# Altium project mPCIe_Breakout01.PrjPCB
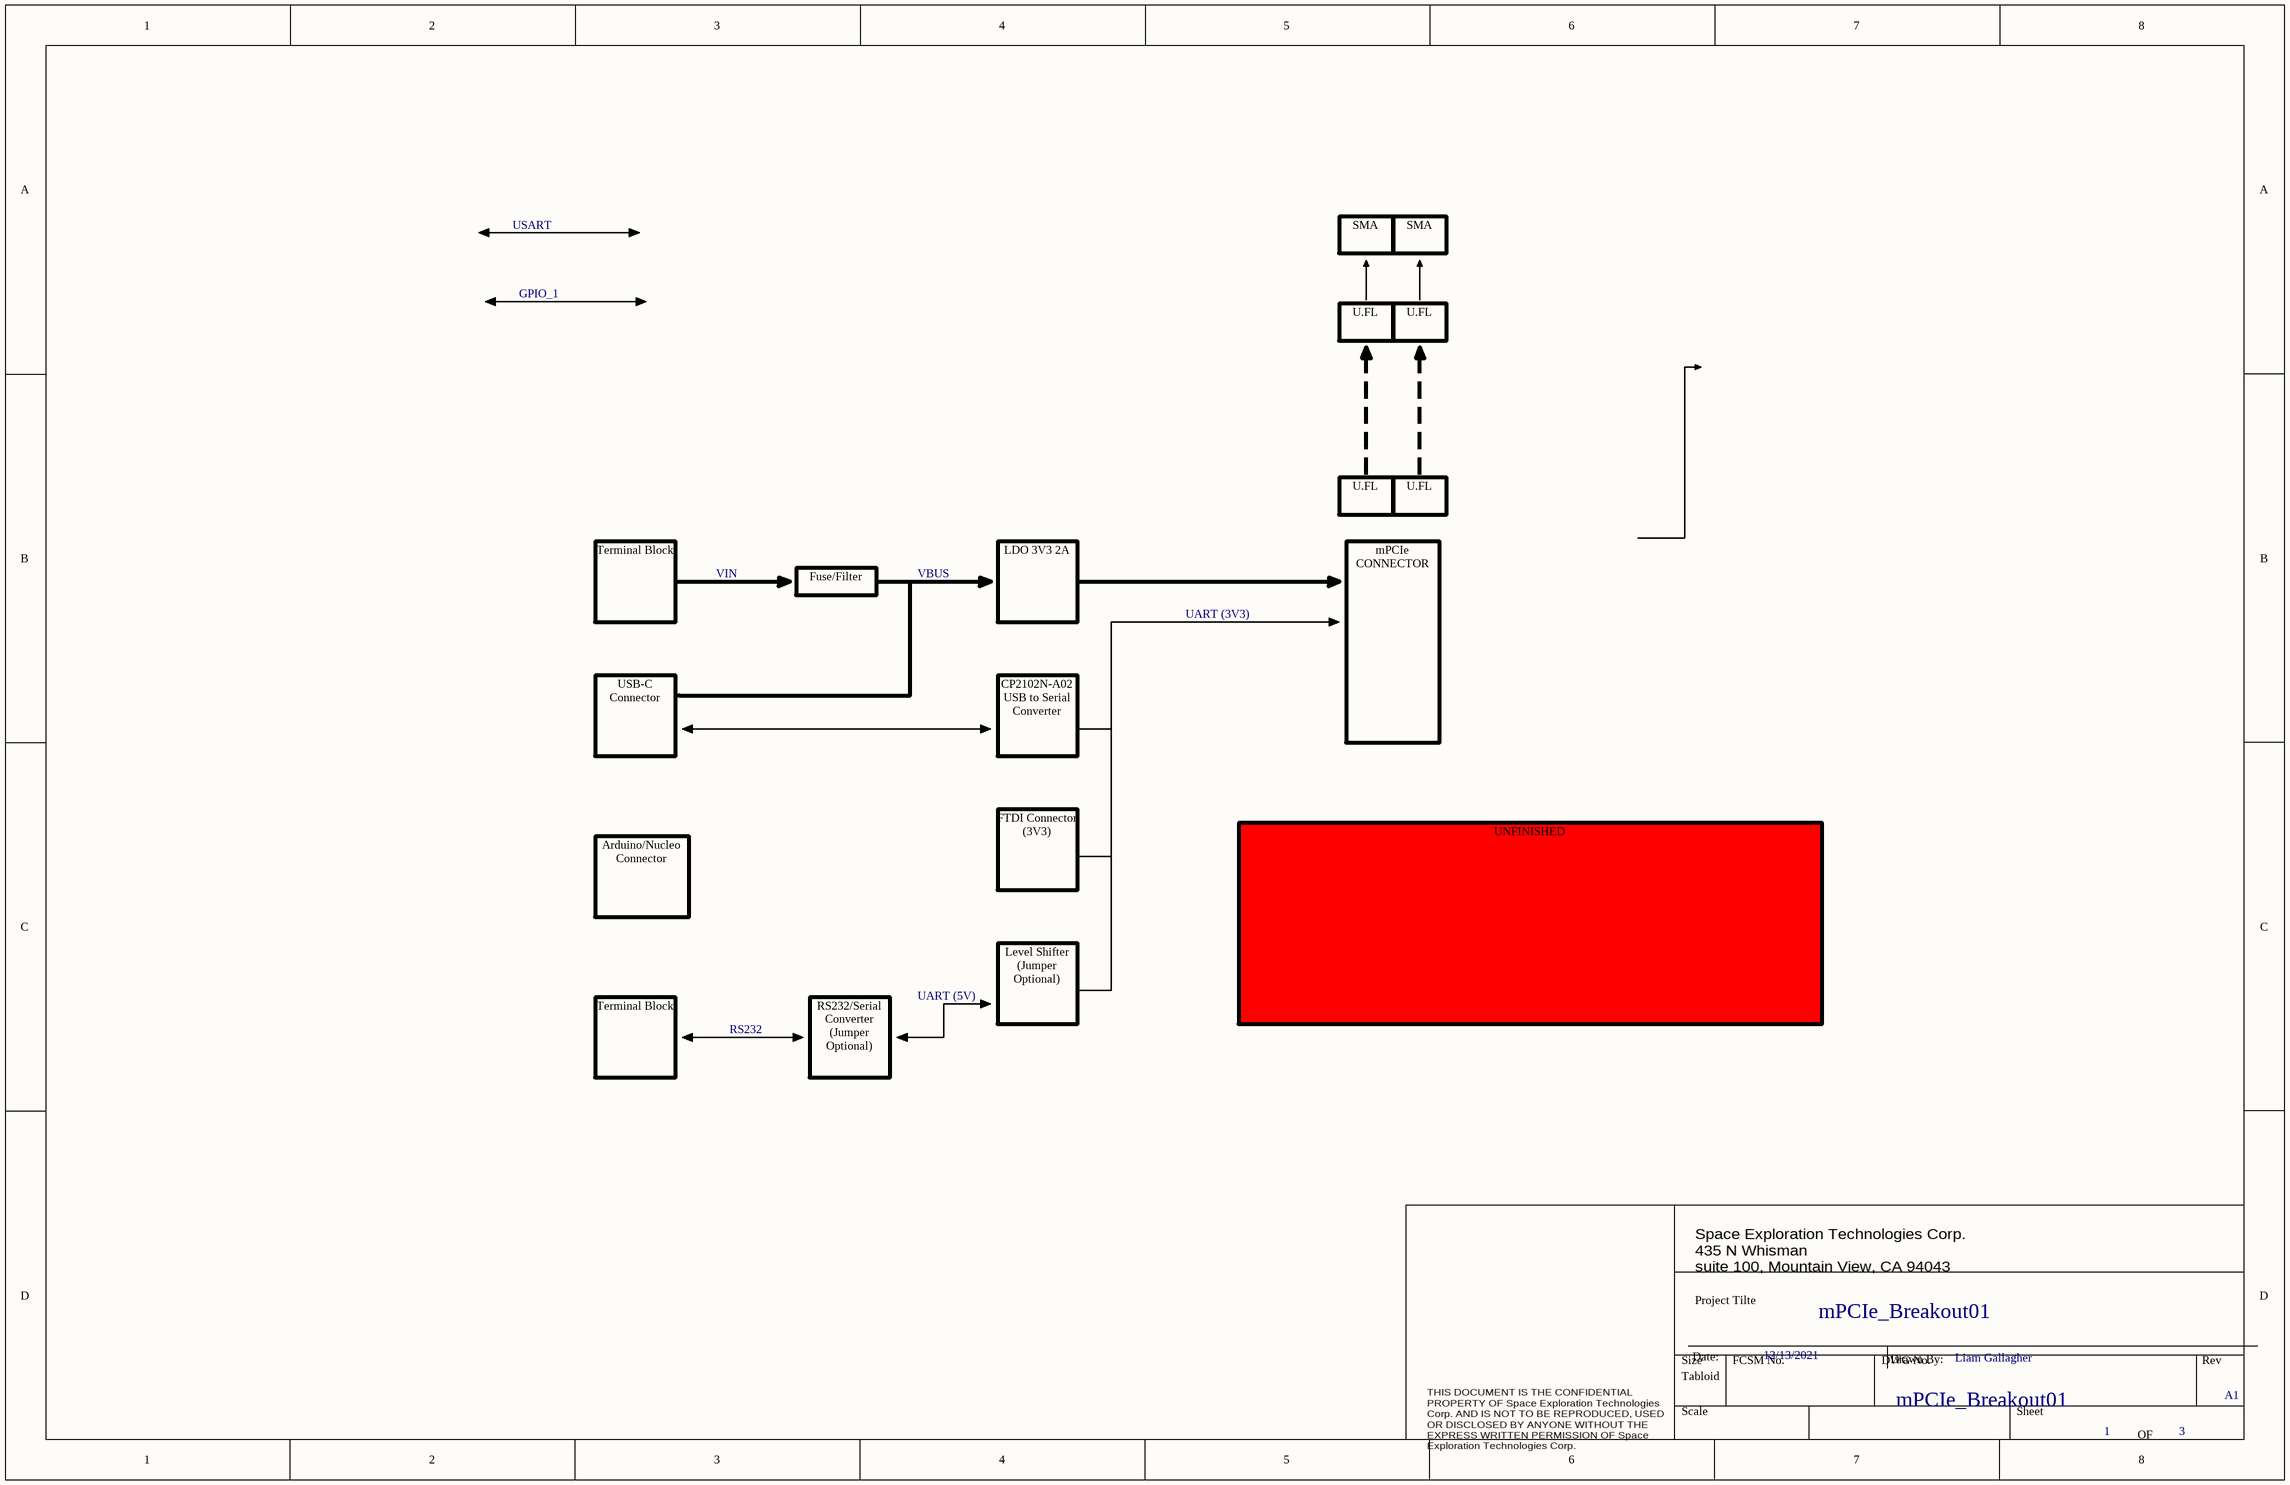
[diagram p0: mPCIe_Breakout01_SCH-PAGE1_TITLE.SchDoc]
Address1: SpaceX; ASSY1_REV: A1; ASSY_NUMBER_1: mPCIe_Breakout01; Company: WWW.SWARM.SPACE; Drawn_By: Liam Gallagher; Drawn_By_Date: 12/13/2021; Engineer: Liam Gallagher; Model: mPCIe_Breakout01; PCB_NUMBER: mPCIe_Breakout01; PCB_REV: A1; Phone#: 3035884323; PRODUCT_GROUP: RF MODULE; Project_Title: mPCIe_Breakout01; Project Root Number: mPCIe_Breakout01; SCH_REV: A1; Schematic: mPCIe_Breakout01; Soldermask_Color: BLACK
3 sheets, 106 parts. Net scope: flat (ports and power ports of the same name join across sheets).
Board files: mPCIe_Breakout01_2X2_PNL.PcbDoc, mPCIe_Breakout01_BRD1.PcbDoc, mPCIe_Breakout01_PCBONLY__12132021847.PcbDoc
Sheets:
  mPCIe_Breakout01_SCH-PAGE1_TITLE.SchDoc
  mPCIe_Breakout01-SCH-PAGE2_MAIN.SchDoc
  mPCIe_Breakout01_SCH-PAGE3_POWER_SUPPLY.SchDoc

## Sheet mPCIe_Breakout01_SCH-PAGE1_TITLE.SchDoc: Swarm mPCIe Breakout
size Tabloid; Date: 12/13/2021; DrawnBy: Liam Gallagher; DocumentNumber: 1; Revision: X1; SheetNumber: 1; SheetTotal: 3

### Notes on the sheet
- USART
- GPIO_1
- SMA
- U.FL
- Terminal Block
- VIN
- Fuse/Filter
- VBUS
- LDO 3V3 2A
- UART (3V3)
- USB-C Connector
- CP2102N-A02
  USB to Serial Converter
- mPCIe CONNECTOR
- FTDI Connector (3V3)
- Arduino/Nucleo Connector
- RS232
- UART (5V)
- Level Shifter
  (Jumper Optional)
- UNFINISHED
- RS232/Serial Converter
  (Jumper Optional)
- Space Exploration Technologies Corp.
  435 N Whisman
  suite 100, Mountain View, CA 94043
- CONFIDENTIAL
- Date:
- Project Tilte
- Drawn By:
- THIS DOCUMENT IS THE CONFIDENTIAL PROPERTY OF Space Exploration Technologies Corp. AND IS NOT TO BE REPRODUCED, USED OR DISCLOSED BY ANYONE WITHOUT THE EXPRESS WRITTEN PERMISSION OF Space Exploration Technologies Corp.
- OF

## Sheet mPCIe_Breakout01-SCH-PAGE2_MAIN.SchDoc: SWARM GATEWAY MCU
size Tabloid; PageSetup: Record=PageOptions|CenterHorizontal=True|CenterVertical=True|PrintScale=0.61|XCorrection=1.00|YCorrection=1.00|PrintKind=1|BorderSize=5000000|LeftOffset=0|BottomOffset=0|Orientation=2|PaperLength=1000|PaperWidth=1000|Scale=100|PaperSource=7|PrintQuality=-4|MediaType=1|DitherType=10|PaperKind=Letter (8.5" x 11")|PrintScaleMode=1; Address1: SpaceX; Address2: SpaceX; DocumentNumber: 2; SheetNumber: 2; SheetTotal: 3; SheetName: Swarm Embedded Gateway MCU
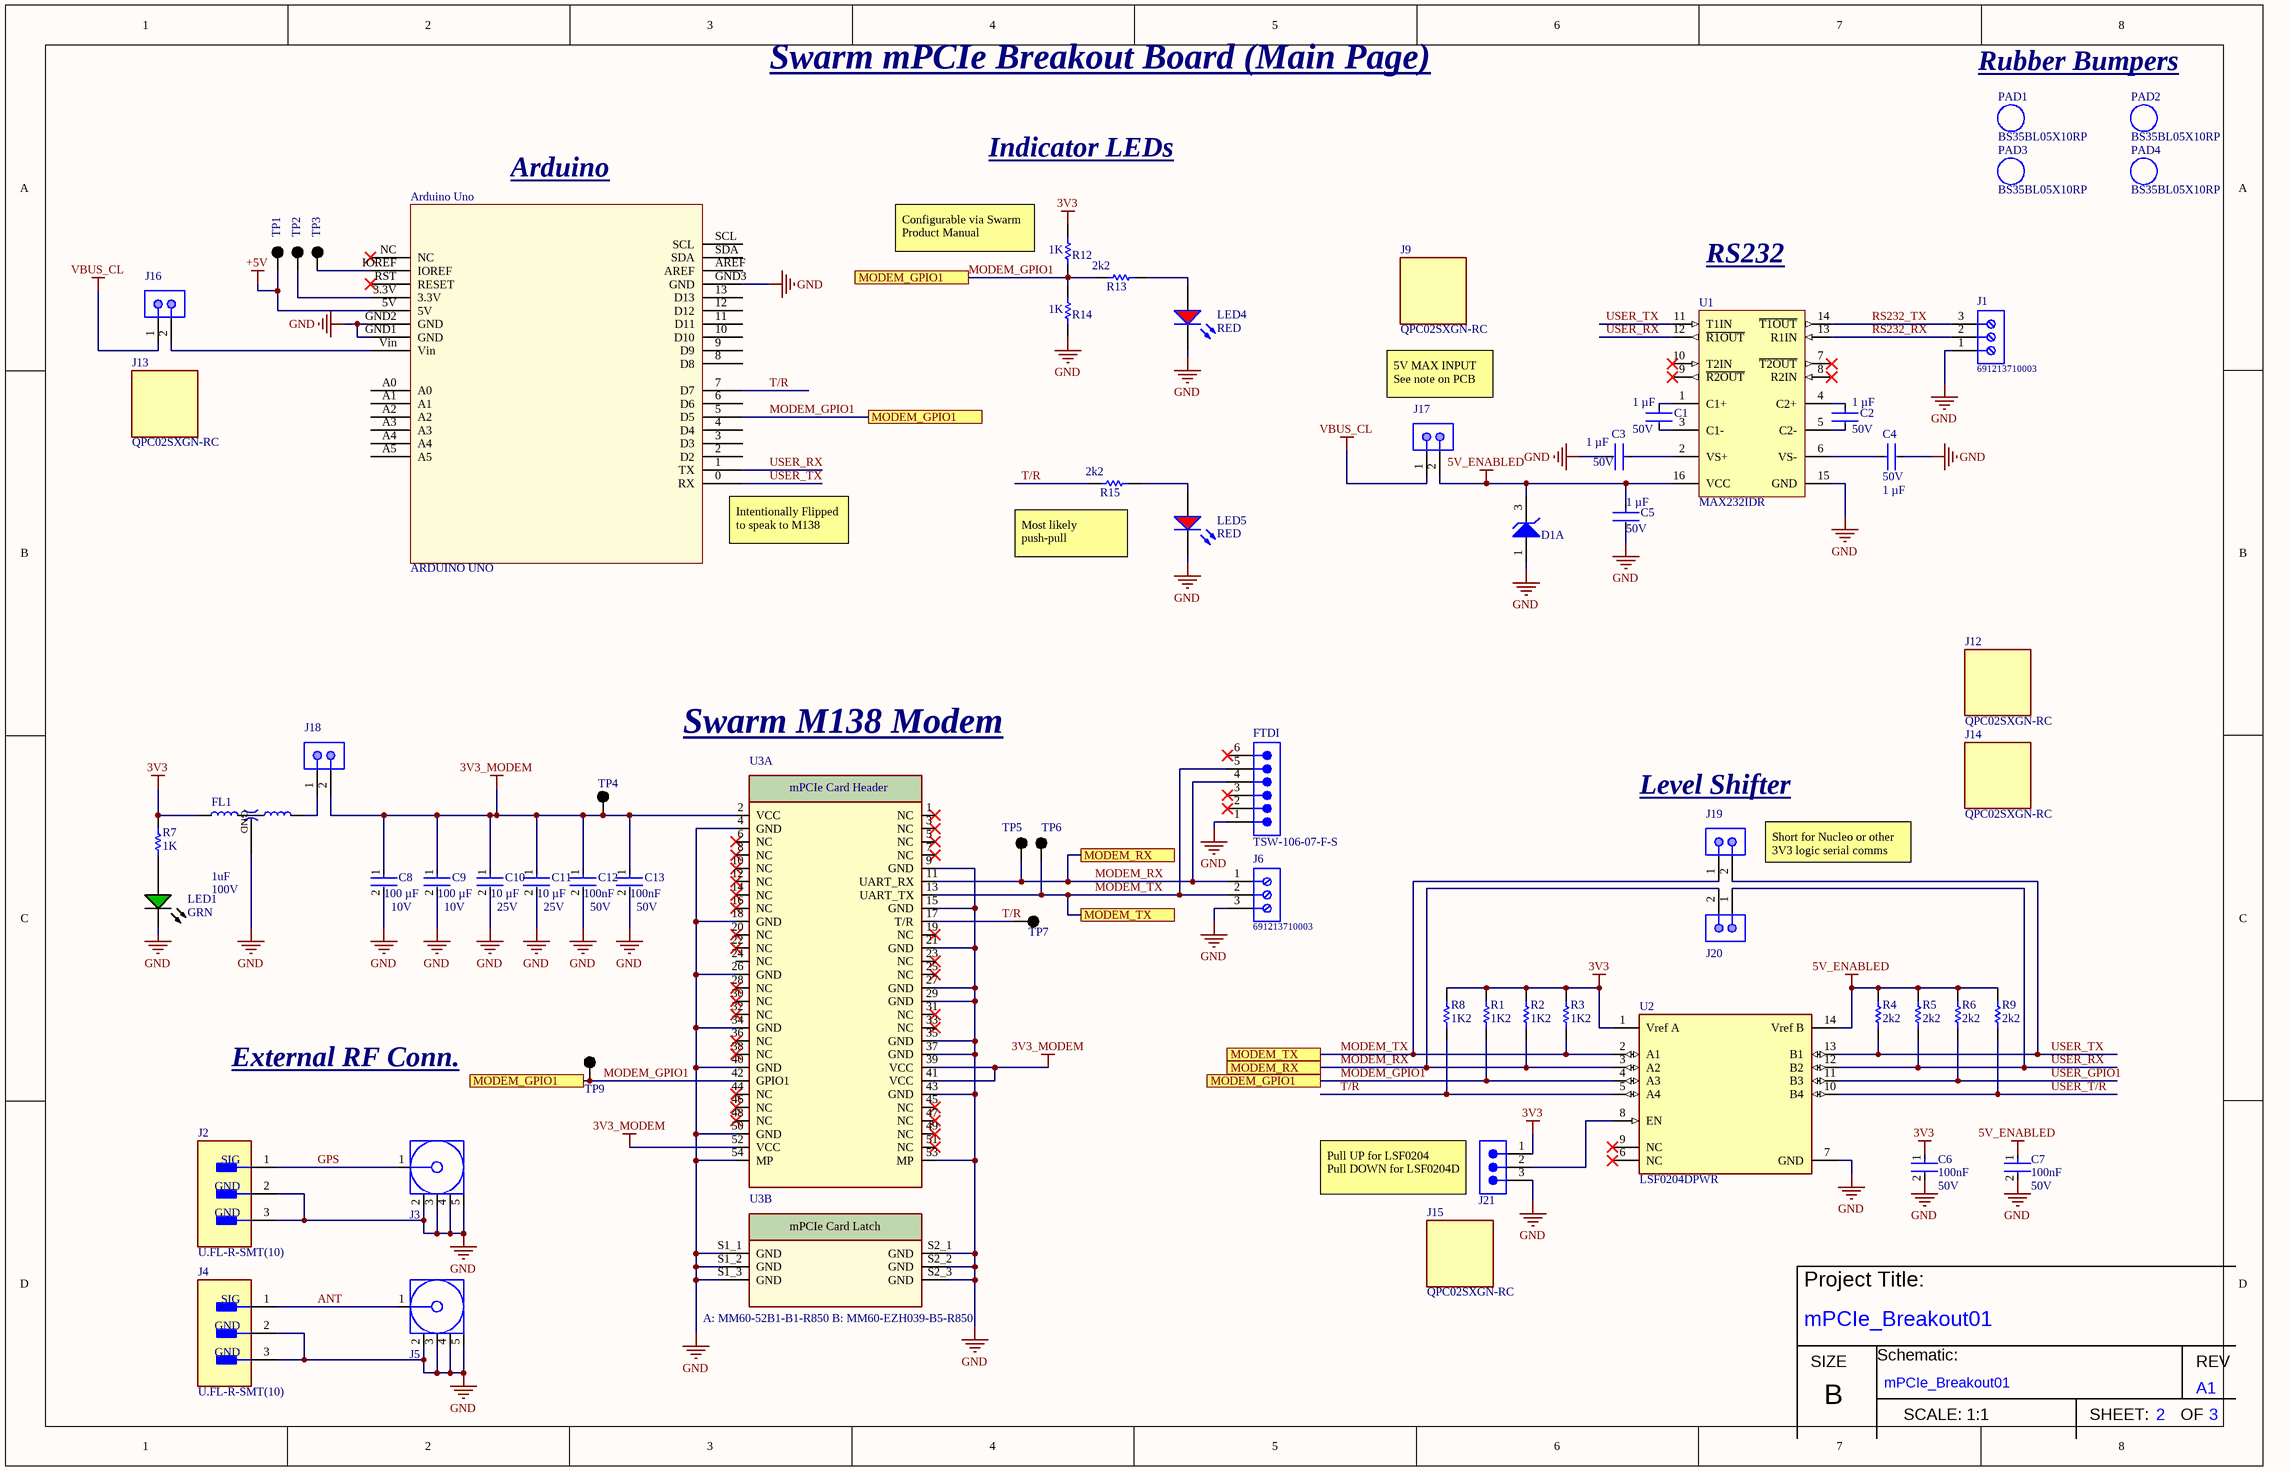
[diagram p1: mPCIe_Breakout01-SCH-PAGE2_MAIN.SchDoc]

### Parts
(Parts that share a designator on the sheet are numbered #1, #2 ... from top to bottom, then left to right.)
?#1  TitleBlock_SpaceX  (value not drawn)  (graphical)
Arduino_Uno  ARDUINO UNO  [Arduino Uno]  (no BOM)
C1  value 1 µF  Voltage: 50V  [FP-CL21-IPC_C]  (hidden comment: CL21B105KBFNNNG)
C2  value 1 µF  Voltage: 50V  [FP-CL21-IPC_C]  (hidden comment: CL21B105KBFNNNG)
C3  value 1 µF  Voltage: 50V  [FP-CL21-IPC_C]  (hidden comment: CL21B105KBFNNNG)
C4  value 1 µF  Voltage: 50V  [FP-CL21-IPC_C]  (hidden comment: CL21B105KBFNNNG)
C5  value 1 µF  Voltage: 50V  [FP-CL21-IPC_C]  (hidden comment: CL21B105KBFNNNG)
C6  value 100nF  Voltage: 50V  [FP-CL10-0_1-MFG]  (hidden comment: CGA3E2X7R1H104K080AA)
C7  value 100nF  Voltage: 50V  [FP-CL10-0_1-MFG]  (hidden comment: CGA3E2X7R1H104K080AA)
C8  value 100 µF  Voltage: 10V  [FP-GRM32E-0_3-0_2-IPC_B]  (hidden comment: GRM32ER61A107ME20L)
C9  value 100 µF  Voltage: 10V  [FP-GRM32E-0_3-0_2-IPC_B]  (hidden comment: GRM32ER61A107ME20L)
C10  value 10 µF  Voltage: 25V  [FP-GRM21B-0_15-IPC_C]  (hidden comment: GRM21BR61E106KA73L)
C11  value 10 µF  Voltage: 25V  [FP-GRM21B-0_15-IPC_C]  (hidden comment: GRM21BR61E106KA73L)
C12  value 100nF  Voltage: 50V  [FP-CL10-0_1-MFG]  (hidden comment: CGA3E2X7R1H104K080AA)
C13  value 100nF  Voltage: 50V  [FP-CL10-0_1-MFG]  (hidden comment: CGA3E2X7R1H104K080AA)
D1  BZX84B5V1LT1G  [ONSC-SOT-23-3-318-08_V]  (value not drawn)  (part A of 2)
FL1  value 1uF  Voltage: 100V  [FIL_YFF31HC2A104MT000N_YFF31HC2A104MT000N]  (hidden comment: YFF31HC2A105MT000N)
FTDI  TSW-106-07-F-S  [SMTC-TSW-106-07-X-S]
J1  691213710003  [691213710003]
J2  U.FL-R-SMT(10)  [FP-U_FL-R-SMT_10-MFG]
J3  CMP-2000-05705-2  [TECO-5-1814832-1_V]  (value not drawn)
J4  U.FL-R-SMT(10)  [FP-U_FL-R-SMT_10-MFG]
J5  CMP-2000-05705-2  [TECO-5-1814832-1_V]  (value not drawn)
J6  691213710003  [691213710003]
J9  QPC02SXGN-RC  [FP-QPC02SXGN-RC-MFG]
J12  QPC02SXGN-RC  [FP-QPC02SXGN-RC-MFG]
J13  QPC02SXGN-RC  [FP-QPC02SXGN-RC-MFG]
J14  QPC02SXGN-RC  [FP-QPC02SXGN-RC-MFG]
J15  QPC02SXGN-RC  [FP-QPC02SXGN-RC-MFG]
J16  TSW-102-07-S-S  [SMTC-TSW-102-07-S-S]  (value not drawn)
J17  TSW-102-07-S-S  [SMTC-TSW-102-07-S-S]  (value not drawn)
J18  TSW-102-07-S-S  [SMTC-TSW-102-07-S-S]  (value not drawn)
J19  TSW-102-07-S-S  [SMTC-TSW-102-07-S-S]  (value not drawn)
J20  TSW-102-07-S-S  [SMTC-TSW-102-07-S-S]  (value not drawn)
J21  TSW-103-07-L-S  [SMTC-TSW-103-07-X-S]  (value not drawn)
LED1  value GRN  [WE-150060VS75000_V]  (hidden comment: 150060VS75000)
LED4  value RED  [0603_A]  (hidden comment: 150060RS75000)
LED5  value RED  [0603_A]  (hidden comment: 150060RS75000)
PAD1  BS35BL05X10RP  [Bumper]
PAD2  BS35BL05X10RP  [Bumper]
PAD3  BS35BL05X10RP  [Bumper]
PAD4  BS35BL05X10RP  [Bumper]
R1  value 1K2  [RESC1608X55X30LL15T15]  (hidden comment: ERJ-3GEYJ122V)
R2  value 1K2  [RESC1608X55X30LL15T15]  (hidden comment: ERJ-3GEYJ122V)
R3  value 1K2  [RESC1608X55X30LL15T15]  (hidden comment: ERJ-3GEYJ122V)
R4  value 2k2  [RESC1609X50X30LL10T20]  (hidden comment: CRCW06032K20JNEA)
R5  value 2k2  [RESC1609X50X30LL10T20]  (hidden comment: CRCW06032K20JNEA)
R6  value 2k2  [RESC1609X50X30LL10T20]  (hidden comment: CRCW06032K20JNEA)
R7  value 1K  [RESC1608X55X30LL20T20]  (hidden comment: ERA3AEB102V)
R8  value 1K2  [RESC1608X55X30LL15T15]  (hidden comment: ERJ-3GEYJ122V)
R9  value 2k2  [RESC1609X50X30LL10T20]  (hidden comment: CRCW06032K20JNEA)
R12  value 1K  [RESC1608X55X30LL20T20]  (hidden comment: ERA3AEB102V)
R13  value 2k2  [RESC1609X50X30LL10T20]  (hidden comment: CRCW06032K20JNEA)
R14  value 1K  [RESC1608X55X30LL20T20]  (hidden comment: ERA3AEB102V)
R15  value 2k2  [RESC1609X50X30LL10T20]  (hidden comment: CRCW06032K20JNEA)
TP1  5001  [KSTN-5001]  (value not drawn)
TP2  5001  [KSTN-5001]  (value not drawn)
TP3  5001  [KSTN-5001]  (value not drawn)
TP4  5001  [KSTN-5001]  (value not drawn)
TP5  5001  [KSTN-5001]  (value not drawn)
TP6  5001  [KSTN-5001]  (value not drawn)
TP7  5001  [KSTN-5001]  (value not drawn)
TP9  5001  [KSTN-5001]  (value not drawn)
U1  MAX232IDR  [D0016A_M]
U2  LSF0204DPWR  [FP-PW0014A-IPC_B]
U3  A: MM60-52B1-B1-R850 B: MM60-EZH039-B5-R850  [RF_VHF_JAE_MM60-52B1-B1-R850_MM60-EZH039-B5-R850_w_2005_mPCIe_card]  (parts A,B of 2)

### Ports
MODEM_GPIO1, MODEM_RX, MODEM_TX

### Nets
3V3: C6.1 FL1.3(OUT/IN) J21.1 R1.2 R2.2 R3.2 R7.2 R8.2 R12.2 U2.1(Vref_A)
3V3_MODEM: C8.1 C9.1 C10.1 C11.1 C12.1 C13.1 J18.2 TP4.1 U3.2(VCC) U3.39(VCC) U3.41(VCC) U3.52(VCC)
5V_ENABLED: C5.1 C7.1 D1.3(K) J17.2 R4.2 R5.2 R6.2 R9.2 U1.16(VCC) U2.14(Vref_B)
+5V: Arduino_Uno.5V TP1.1
GND: Arduino_Uno.GND1(GND) Arduino_Uno.GND2(GND) Arduino_Uno.GND3(GND) C3.2 C4.2 C5.2 C6.2 C7.2 C8.2 C9.2 C10.2 C11.2 C12.2 C13.2 D1.1(A) FL1.2_4(GND) FTDI.1 J1.1 J2.2(GND) J2.3(GND) J3.2 J3.3 J3.4 J3.5 J4.2(GND) J4.3(GND) J5.2 J5.3 J5.4 J5.5 J6.3 J21.3 LED1.1(K) LED4.1(K) LED5.1(K) R14.1 U1.15(GND) U2.7(GND) U3.4(GND) U3.9(GND) U3.15(GND) U3.18(GND) U3.21(GND) U3.26(GND) U3.27(GND) U3.29(GND) U3.34(GND) U3.35(GND) U3.37(GND) U3.40(GND) U3.43(GND) U3.50(GND) U3.53(MP) U3.54(MP) U3.S1_1(GND) U3.S1_2(GND) U3.S1_3(GND) U3.S2_1(GND) U3.S2_2(GND) U3.S2_3(GND)
VBUS_CL: J16.1 J17.1
ANT: J4.1(SIG) J5.1
GPS: J2.1(SIG) J3.1
MODEM_GPIO1: Arduino_Uno.5(D5) R1.1 R12.1 R13.2 R14.2 TP9.1 U2.4(A3) U3.42(GPIO1) ; port MODEM_GPIO1
MODEM_RX: FTDI.4 J6.1 J20.2 R2.1 TP5.1 U2.3(A2) U3.11(UART_RX) ; port MODEM_RX
MODEM_TX: FTDI.5 J6.2 J19.1 R3.1 TP6.1 U2.2(A1) U3.13(UART_TX) ; port MODEM_TX
RS232_RX: J1.2 U1.13(R1IN)
RS232_TX: J1.3 U1.14(~{T1OUT})
T/R: Arduino_Uno.7(D7) R8.1 R15.2 TP7.1 U2.5(A4) U3.17(T/R)
USER_GPIO1: R6.1 U2.11(B3)
USER_RX: Arduino_Uno.1(TX) J20.1 R5.1 U1.12(~{R1OUT}) U2.12(B2)
USER_T/R: R9.1 U2.10(B4)
USER_TX: Arduino_Uno.0(RX) J19.2 R4.1 U1.11(T1IN) U2.13(B1)
NetArduino_Uno_3.3V: Arduino_Uno.3.3V TP2.1
NetArduino_Uno_IOREF: Arduino_Uno.IOREF TP3.1
NetArduino_Uno_Vin: Arduino_Uno.Vin J16.2
NetC1_1: C1.1 U1.1(C1+)
NetC1_2: C1.2 U1.3(C1-)
NetC2_1: C2.1 U1.4(C2+)
NetC2_2: C2.2 U1.5(C2-)
NetC3_1: C3.1 U1.2(VS+)
NetC4_1: C4.1 U1.6(VS-)
NetFL1_1: FL1.1(IN/OUT) J18.1
NetJ21_2: J21.2 U2.8(EN)
NetLED1_2: LED1.2(A) R7.1
NetLED4_2: LED4.2(A) R13.1
NetLED5_2: LED5.2(A) R15.1

Not connected (* = marked no-connect by the designer): Arduino_Uno 2(D2) 3(D3) 4(D4) 6(D6) 8(D8) 9(D9) 10(D10) 11(D11) 12(D12) 13(D13) A0 A1 A2 A3 A4 A5 AREF NC* RST(RESET)* SCL SDA; FTDI 2* 3* 6*; U1 7(~{T2OUT})* 8(R2IN)* 9(~{R2OUT})* 10(T2IN)*; U2 6(NC)* 9(NC)*; U3 1(NC)* 3(NC)* 5(NC)* 6(NC)* 7(NC)* 8(NC)* 10(NC)* 12(NC)* 14(NC)* 16(NC)* 19(NC)* 20(NC)* 22(NC)* 23(NC)* 24(NC) 25(NC)* 28(NC)* 30(NC)* 31(NC)* 32(NC)* 33(NC)* 36(NC)* 38(NC)* 44(NC)* 45(NC)* 46(NC)* 47(NC)* 48(NC)* 49(NC)* 51(NC)*

### Notes on the sheet
- Swarm mPCIe Breakout Board (Main Page)
- Rubber Bumpers
- Indicator LEDs
- Arduino
- (near R12) Configurable via Swarm Product Manual
- RS232
- 5V MAX INPUT
  See note on PCB
- (near Arduino_Uno) Intentionally Flipped to speak to M138
- (near R15) Most likely push-pull
- Swarm M138 Modem
- Level Shifter
- (near J19) Short for Nucleo or other 3V3 logic serial comms
- External RF Conn.
- Pull UP for LSF0204
  Pull DOWN for LSF0204D
- (in symbol SWARM_M138_mPCIe_2.005"_VHF, part A) mPCIe Card Header
- (in symbol SWARM_M138_mPCIe_2.005"_VHF, part B) mPCIe Card Latch
- (in symbol TitleBlock_SpaceX) Project Title:; Schematic:; SIZE; REV; B; SCALE: 1:1; SHEET:       OF

### Library data of the parts
?#1 = TitleBlock_SpaceX: TITLE
Arduino_Uno = ARDUINO UNO: UNO; MANUF1: TBD; Value: TBD; MANUF1 P/N: TBD; Manufacturer: TBD; Manufacturer Part Number: TBD; Size: TH; SPECIAL_INSTRUCTIONS: TBD; Supplier: Digi-Key; Supplier P/N: TBD; TEMP: TBD; Tolerance: TBD; Type: TBD; Voltage: TBD
C1-C5 = CMP-13271-001433-1: CL21 Series 0805 1uF 50V ±10% Tolerance X7R Multilayer Ceramic Chip Capacitor; Manufacturer: Samsung; TEMP: -55°C ~ 125°C; Type: CAP; Tolerance: 10%; Manufacturer Part Number: CL21B105KBFNNNG; MANUF1: Samsung; MANUF1 P/N: CL21B105KBFNNNG; Size: 0805; SPECIAL_INSTRUCTIONS: CL21B105KBFNNNG; Supplier: Digi-Key; Supplier P/N: 1276-6470-2-ND
C6 C7 C12 C13 = CMP-13271-000011-1: Cap Ceramic 100nF 50V X7R 10% Pad SMD 0603 +125°C Automotive T/R; Manufacturer: TDK; TEMP: -55°C ~ 125°C; Tolerance: 10%; Manufacturer Part Number: CGA3E2X7R1H104K080AA; MANUF1: TDK; MANUF1 P/N: CGA3E2X7R1H104K080AA; Size: 0603; SPECIAL_INSTRUCTIONS: CGA3E2X7R1H104K080AA; Supplier: Digi-Key; Supplier P/N: 1276-1033-2-ND; Type: CAP
C8 C9 = CMP-06035-048205-1: Chip Multilayer Ceramic Capacitors for General Purpose, 1210, 100uF, X5R, 15%, 20%, 10V; Manufacturer: Murata; TEMP: -55°C ~ 85°C; Type: CAP; Tolerance: 20%; Manufacturer Part Number: GRM32ER61A107ME20L; MANUF1: Murata; MANUF1 P/N: GRM32ER61A107ME20L; Size: 1210; SPECIAL_INSTRUCTIONS: GRM32ER61A107ME20L; Supplier: Digi-Key; Supplier P/N: 490-9969-2-ND
C10 C11 = CMP-2007-03541-2: Chip Multilayer Ceramic Capacitors for General Purpose, 0805, 10uF, X5R, 15%, 10%, 25V; Manufacturer: Murata; TEMP: -55°C ~ 85°C; Type: CAP; Tolerance: 10%; Manufacturer Part Number: GRM21BR61E106KA73L; MANUF1: Murata; MANUF1 P/N: GRM21BR61E106KA73L; Size: 0805; SPECIAL_INSTRUCTIONS: GRM21BR61E106KA73L; Supplier: Digi-Key; Supplier P/N: 490-5523-2-ND
D1 = CMP-1060-00898-1: Zener Voltage Regulator, 225 mW, 3-Pin SOT-23, Pb-Free, Tape and Reel; Manufacturer: ON Semiconductor; TEMP: -65°C ~ 150°C; Tolerance: NA; Value: 225 mW; Voltage: 5.1V; Manufacturer Part Number: BZX84B5V1LT1G; MANUF1: ON Semiconductor; MANUF1 P/N: BZX84B5V1LT1G; Size: SOT-23; SPECIAL_INSTRUCTIONS: BZX84B5V1LT1G; Supplier: Digi-Key; Supplier P/N: BZX84B5V1LT1GOSTR-ND; Type: ZENER
FL1 = CAP FEEDTHRU 1UF 20% 100V 1206: Feed Through Capacitor 100V 5mOhm 1206 (3216 Metric), 4 PC Pad; MANUF1: TDK Corporation; Tolerance: 10%; TEMP: -55°C ~ 125°C; 1K COST: 0.19; Size: 1206; SPECIAL_INSTRUCTIONS: YFF31HC2A105MT000N; Supplier: Digikey; Supplier P/N: 445-16151-2-ND; Type: N/A; MANUF1 P/N: YFF31HC2A105MT000N; Manufacturer: TDK Corporation; Manufacturer Part Number: YFF31HC2A105MT000N
FTDI = CMP-1024-00385-1: 0.025" SQ Post Header, Through-hole, Vertical, -55 to 125 degC, 2.54 mm Pitch, 6-Pin, Male, RoHS; Manufacturer: Samtec; TEMP: -55°C ~ 125°C; Tolerance: NA; Value: NA; Manufacturer Part Number: TSW-106-07-F-S; MANUF1: Samtec; MANUF1 P/N: TSW-106-07-F-S; Size: TH; SPECIAL_INSTRUCTIONS: TSW-106-07-F-S; Supplier: Digi-Key; Supplier P/N: SAM10852-ND; Type: CONN; Voltage: NA
J1 J6 = 691213710003: HEADER, 3 Position Wire to Board Terminal Block Horizontal with Board 0.197" (5.00mm) Through Hole; MANUF1: Wurth Electronics Inc.; 1K COST: .93; TEMP: -40°C ~ 105°C; Tolerance: NA; Value: Green; Voltage: 300V; MANUF1 P/N: 691213710003; Size: 5mm; SPECIAL_INSTRUCTIONS: 691213710003; Supplier: Digikey; Supplier P/N: 732-2039-ND; Type: Wire to Board; Manufacturer: Wurth Electronics Inc.; Manufacturer Part Number: 691213710003
J2 J4 = CMP-0029-00003-2: CONN U.FL RCPT STR 50 OHM SMD; Manufacturer: Hirose; TEMP: -40°C ~ 90°C; Tolerance: NA; Value: NA; Manufacturer Part Number: U.FL-R-SMT(10); MANUF1: Hirose; MANUF1 P/N: U.FL-R-SMT(10); Size: SMT; SPECIAL_INSTRUCTIONS: U.FL-R-SMT(10); Supplier: Digikey; Supplier P/N: H9161TR-ND; Type: CONN; Voltage: NA
J3 J5 = CMP-2000-05705-2: Rf Coax Conn, Sma Jack, 50 Ohm, Pcb Rohs Compliant: Yes; Manufacturer: TE Connectivity; Manufacturer Part Number: 5-1814832-2; TEMP: -65°C ~ 165°C; Voltage: 335 V; Supplier: Digikey; Supplier P/N: 17-5-1814832-2CT-ND; Type: Jack, Female Socket; RoHS: Yes; Category: RF / Coaxial Connectors; Pricing 1: 1=3.00000, 10=2.88300, 25=2.64280, 50=2.52240, 100=2.40240, 250=2.10208, 500=2.04202 (USD); Stock 1: 4896; Supplier 1: Digi-Key; Supplier Part Number 1: 17-5-1814832-2CT-ND
J9 J12-J15 = CMP-25666-000001-1: CONN JUMPER SHORTING .100" GOLD; Manufacturer: Sullins; TEMP: -40°C ~ 85°C; Tolerance: NA; Value: 3A; Manufacturer Part Number: QPC02SXGN-RC; MANUF1: Sullins; MANUF1 P/N: QPC02SXGN-RC; Size: 2.54MM; SPECIAL_INSTRUCTIONS: QPC02SXGN-RC; Supplier: Digi-Key; Supplier P/N: S9337-ND; Type: JUMPER; Voltage: NA
J16-J20 = CMP-1681-00004-4: Male Header, Pitch 2.54 mm, 1 x 2 Position, Height 8.38 mm, Tail Length 2.54 mm, -55 to 125 degC, RoHS, Bulk; Manufacturer: Samtec; TEMP: -55°C ~ 125°C; Tolerance: NA; Value: NA; Manufacturer Part Number: TSW-102-07-S-S; MANUF1: Samtec; MANUF1 P/N: TSW-102-07-S-S; Size: TH; SPECIAL_INSTRUCTIONS: TSW-102-07-S-S; Supplier: Digi-Key; Supplier P/N: SAM1033-02-ND; Type: CONN; Voltage: NA
J21 = CMP-1024-00334-1: 0.025" SQ Post Header, Through-hole, Vertical, -55 to 125 degC, 2.54 mm Pitch, 3-Pin, Male, RoHS; Manufacturer: Samtec; TEMP: -55°C ~ 125°C; Tolerance: NA; Value: NA; Manufacturer Part Number: TSW-103-07-L-S; MANUF1: Samtec; MANUF1 P/N: TSW-103-07-L-S; Size: TH; SPECIAL_INSTRUCTIONS: TSW-103-07-L-S; Supplier: Digi-Key; Supplier P/N: SAM1031-03-ND; Type: CONN; Voltage: NA
LED1 = CMP-1426-00006-4: WL-SMCW SMD Chip LED Top View Monocolor Waterclear, 30 mA, 2 V, -40 to 85 degC, 2-Pin SMD, RoHS, Tape and Reel GRN; Manufacturer: Wurth Electronics; TEMP: 40 up to +85 °C; Tolerance: NA; Voltage: 25V; Manufacturer Part Number: 150060VS75000; MANUF1: Wurth Electronics; MANUF1 P/N: 150060VS75000; Size: 0603; SPECIAL_INSTRUCTIONS: 150060VS75000; Supplier: Digi-Key; Supplier P/N: 732-4980-2-ND; Type: LED
LED4 LED5 = CMP-1426-00001-1: SMD mono-color Chip LED, WL-SMCW, Red; Manufacturer: Wurth Electronics; TEMP: 40 up to +85 °C; Tolerance: NA; Voltage: 25V; Manufacturer Part Number: 150060RS75000; MANUF1: Wurth Electronics; MANUF1 P/N: 150060RS75000; Size: 0603; SPECIAL_INSTRUCTIONS: 150060RS75000; Supplier: Digikey; Supplier P/N: 732-4978-2-ND; Type: LED
PAD1-PAD4 = BS35BL05X10RP: BUMPER CYLI .375" DIA X .19" BLK
R1-R3 R8 = CMP-1012-00076-2: RES SMD 1.2K OHM 5% 1/10W 0603; Manufacturer: Bourns; Manufacturer Part Number: CR0603-JW-122ELF; TEMP: -55°C ~ 155°C; Voltage: NA; MANUF1: Bourns; MANUF1 P/N: CR0603-JW-122ELF; Size: 0603; SPECIAL_INSTRUCTIONS: CR0603-JW-122ELF; Supplier: Digikey; Supplier P/N: 118-CR0603-JW-122ELFTR-ND; Tolerance: ±5%; Type: RES
R4-R6 R9 R13 R15 = CMP-2000-03169-1: RES SMD 2.2K OHM 5% 1/10W 0603; Manufacturer: Vishay; TEMP: -55°C ~ 155°C; Voltage: NA; Manufacturer Part Number: CRCW06032K20JNEA; MANUF1: Vishay; MANUF1 P/N: CRCW06032K20JNEA; Size: 0603; SPECIAL_INSTRUCTIONS: CRCW06032K20JNEA; Supplier: Digi-Key; Supplier P/N: 541-2.2KGTR-ND; Tolerance: ±5%; Type: RES
R7 R12 R14 = CMP-2000-00873-1: RES SMD 1K OHM 0.1% 1/10W 0603; Manufacturer: Panasonic; Manufacturer Part Number: ERA-3AEB102V; TEMP: -55°C ~ 155°C; Voltage: NA; MANUF1: Panasonic; MANUF1 P/N: ERA-3AEB102V; Size: 0603; SPECIAL_INSTRUCTIONS: ERA-3AEB102V; Supplier: Digi-Key; Supplier P/N: P1.0KDBTR-ND; Tolerance: ±0.1%; Type: RES
TP1-TP7 TP9 = CMP-2000-05181-1: Test Point, Black, 1-Pin THD, RoHS, Bulk; Manufacturer: Keystone Electronics; TEMP: NA; Value: NA; Type: TEST POINT; Manufacturer Part Number: 5001; MANUF1: Keystone Electronics; MANUF1 P/N: 5001; Size: TH; SPECIAL_INSTRUCTIONS: 5001; Supplier: Digikey; Supplier P/N: 36-5001-ND; Tolerance: NA; Voltage: NA
U1 = CMP-0299-00110-2: Dual EIA-232 Driver / Receiver, -40 to 85 degC, 16-Pin SOIC (D), Green (RoHS & no Sb/Br); Manufacturer: Texas Instruments; TEMP: -40°C ~ 85°C; Tolerance: NA; Value: NA; Voltage: 4.5V ~ 5.5V; Manufacturer Part Number: MAX232IDR; MANUF1: Texas Instruments; MANUF1 P/N: MAX232IDR; Size: 16SOIC; SPECIAL_INSTRUCTIONS: MAX232IDR; Supplier: Digi-Key; Supplier P/N: 296-26141-2-ND; Type: IC
U2 = CMP-04899-000085-1: IC TRNSLTR BIDIRECTIONAL 14TSSOP; Manufacturer: Texas Instruments; TEMP: -40°C ~ 125°C; Tolerance: NA; Value: NA; Voltage: 0.8/1.8 V ~ 4.5/5.5 V; Manufacturer Part Number: LSF0204DPWR; MANUF1: Texas Instruments; MANUF1 P/N: LSF0204DPWR; SPECIAL_INSTRUCTIONS: LSF0204DPWR; Supplier: Digi-Key; Supplier P/N: 296-40400-2-ND; Type: IC
U3 = SWARM_M138_mPCIe_2.005"_VHF: SWARM M138 MODEM mPCIe 2.005" (50.925mm) x 1.18" (30mm)  Two part connector; MANUF1: JAE; Tolerance: NA; TEMP: -40°C ~ 85°C; Value: NA; Size: mPCIe; SPECIAL_INSTRUCTIONS: A: MM60-52B1-B1-R850 B: MM60-EZH039-B5-R850; Supplier: Digikey; Supplier P/N: A: 670-2274-2-ND B: 670-2276-2-ND; Type: CONN; MANUF1 P/N: A: MM60-52B1-B1-R850 B: MM60-EZH039-B5-R850; Manufacturer: JAE; Manufacturer Part Number: A: MM60-52B1-B1-R850 B: MM60-EZH039-B5-R850; Voltage: NA

## Sheet mPCIe_Breakout01_SCH-PAGE3_POWER_SUPPLY.SchDoc: SWARM GATEWAY MCU
size Tabloid; PageSetup: Record=PageOptions|CenterHorizontal=True|CenterVertical=True|PrintScale=0.61|XCorrection=1.00|YCorrection=1.00|PrintKind=1|BorderSize=5000000|LeftOffset=0|BottomOffset=0|Orientation=2|PaperLength=1000|PaperWidth=1000|Scale=100|PaperSource=7|PrintQuality=-4|MediaType=1|DitherType=10|PaperKind=Letter (8.5" x 11")|PrintScaleMode=1; Address1: SpaceX; Address2: SpaceX; DocumentNumber: 3; SheetNumber: 3; SheetTotal: 3; SheetName: Swarm Embedded Gateway MCU
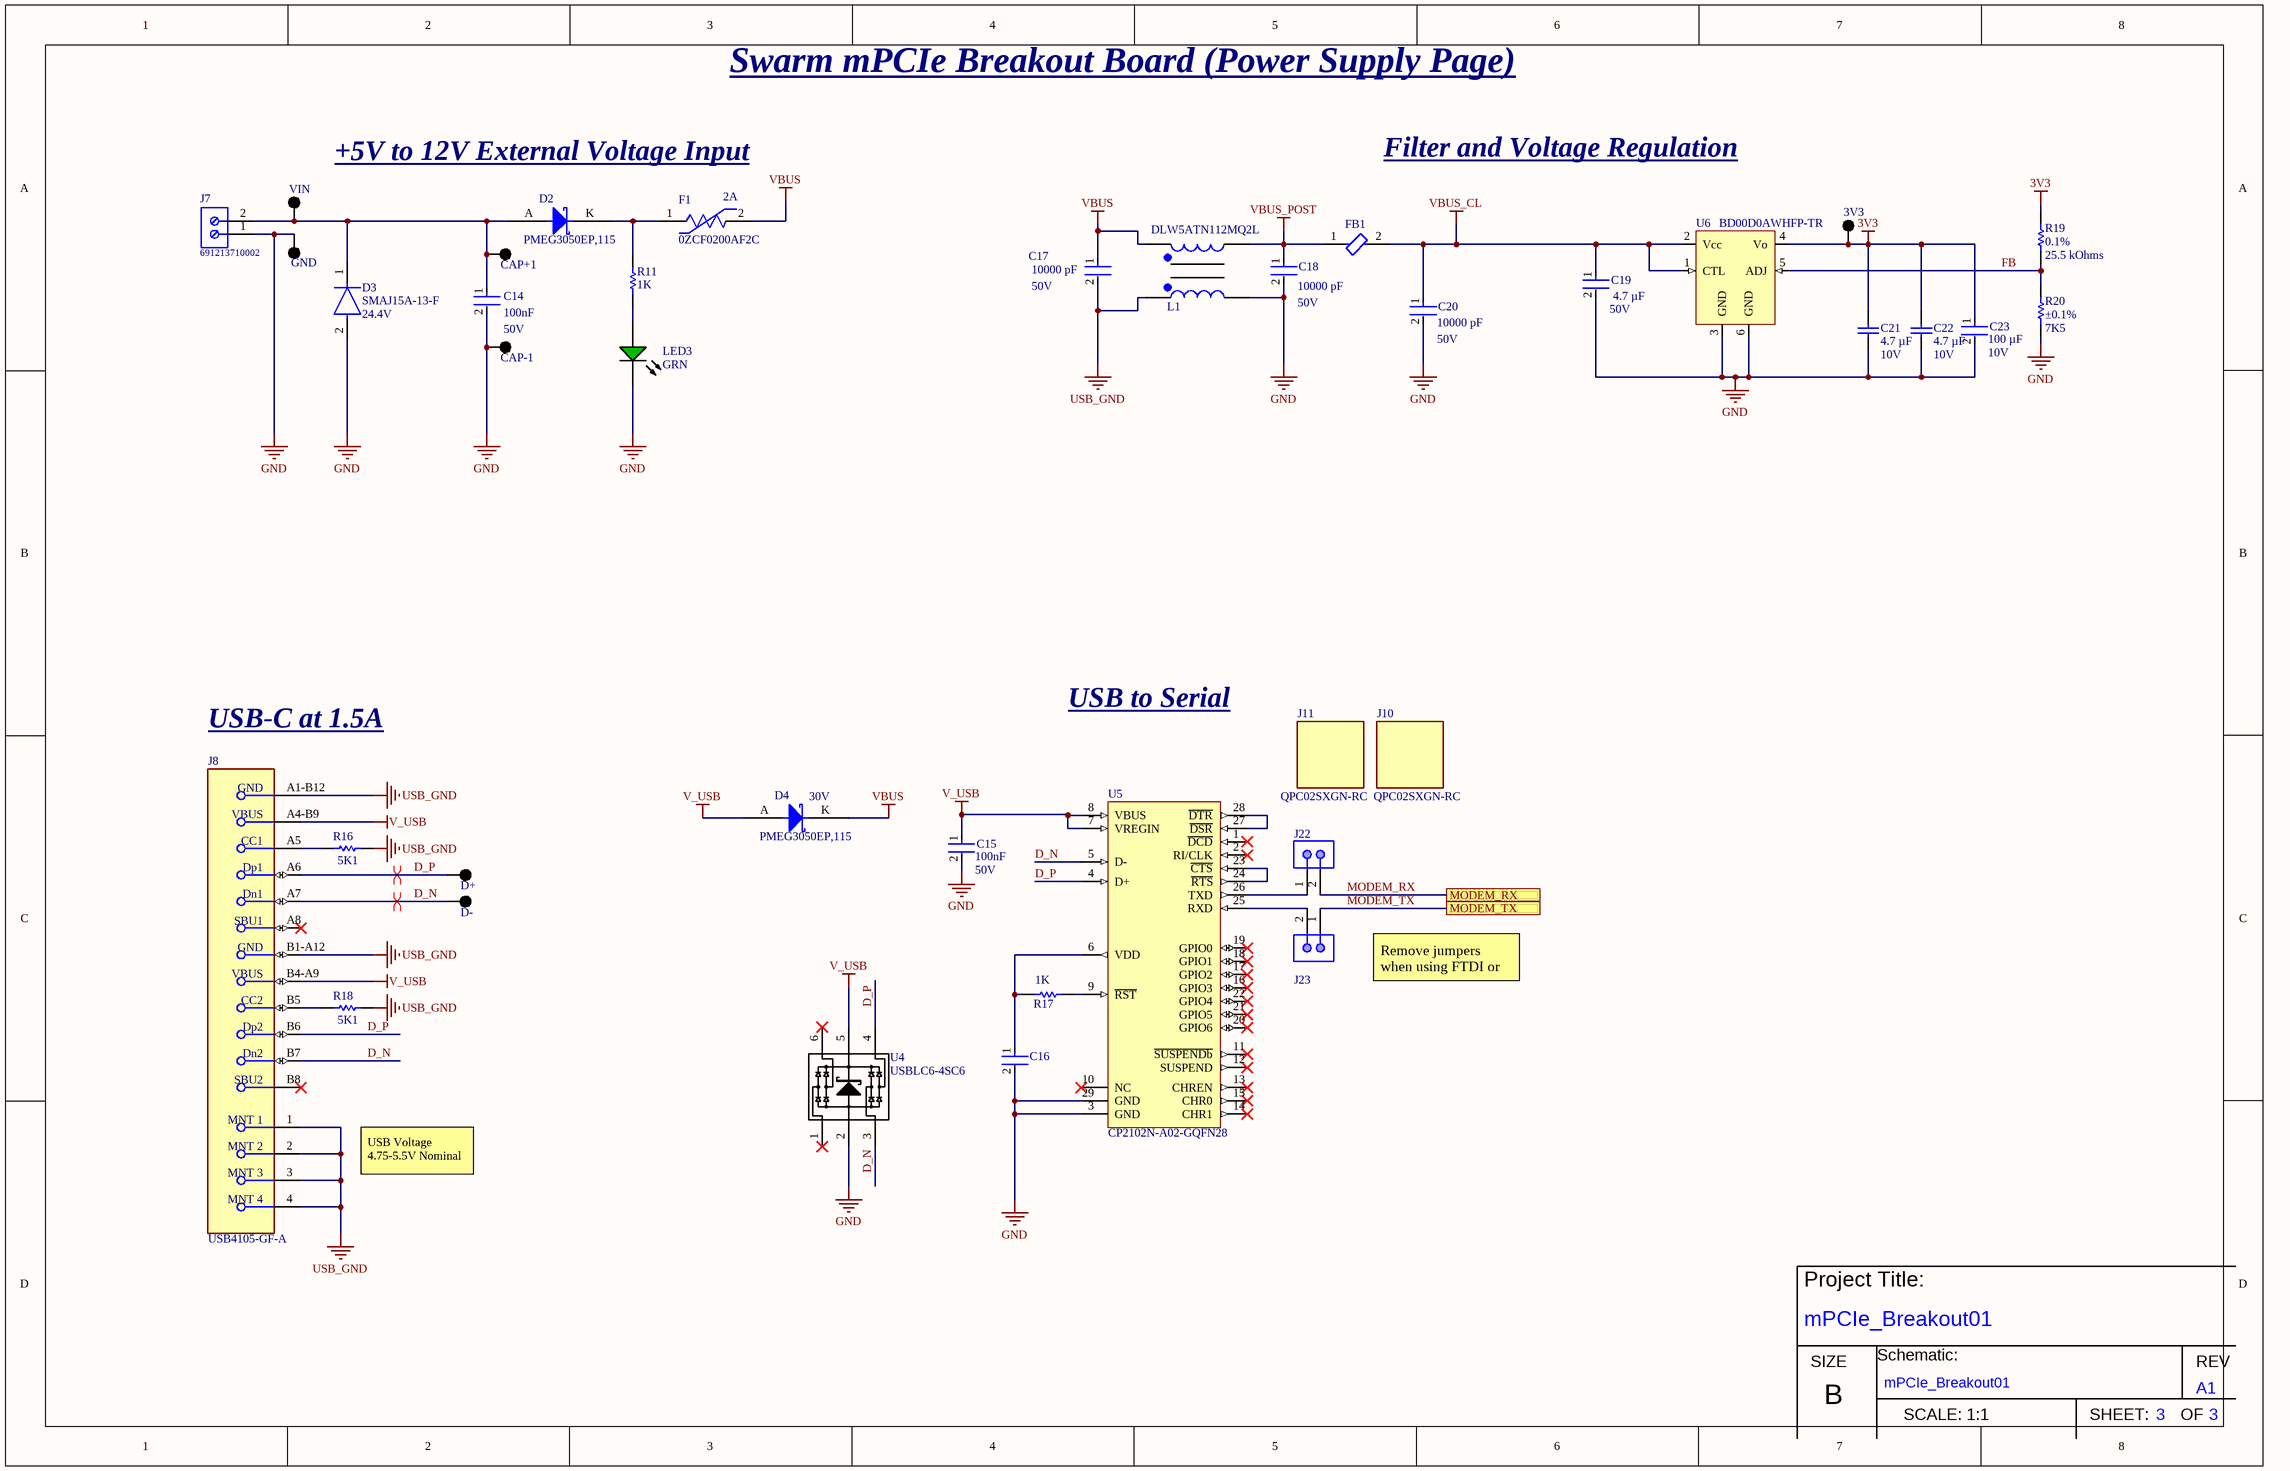
[diagram p2: mPCIe_Breakout01_SCH-PAGE3_POWER_SUPPLY.SchDoc]

### Parts
(Parts that share a designator on the sheet are numbered #1, #2 ... from top to bottom, then left to right.)
3V3  5001  [KSTN-5001]  (value not drawn)
?#2  TitleBlock_SpaceX  (value not drawn)  (graphical)
C14  value 100nF  Voltage: 50V  [FP-CL10-0_1-MFG]  (hidden comment: CGA3E2X7R1H104K080AA)
C15  value 100nF  Voltage: 50V  [FP-CL10-0_1-MFG]  (hidden comment: CGA3E2X7R1H104K080AA)
C16  CGA3E2X7R1H104K080AA  [FP-CL10-0_1-MFG]  (value not drawn)
C17  value 10000 pF  Voltage: 50V  [FP-GRM219-0_1-IPC_B]  (hidden comment: GRM2195C1H103JA01D)
C18  value 10000 pF  Voltage: 50V  [FP-GRM219-0_1-IPC_B]  (hidden comment: GRM2195C1H103JA01D)
C19  value 4.7 µF  Voltage: 50V  [FP-GRM31C-0_2-e0_3_0_8-IPC_C]  (hidden comment: GRM31CR71H475KA12L)
C20  value 10000 pF  Voltage: 50V  [FP-GRM219-0_1-IPC_B]  (hidden comment: GRM2195C1H103JA01D)
C21  value 4.7 µF  Voltage: 10V  [CAPC2013X135X45LL10T25]  (hidden comment: GRM21BR71A475KA73L)
C22  value 4.7 µF  Voltage: 10V  [CAPC2013X135X45LL10T25]  (hidden comment: GRM21BR71A475KA73L)
C23  value 100 µF  Voltage: 10V  [FP-GRM32E-0_3-0_2-IPC_B]  (hidden comment: GRM32ER61A107ME20L)
CAP+1  5001  [KSTN-5001]  (value not drawn)
CAP-1  5001  [KSTN-5001]  (value not drawn)
D2  PMEG3050EP,115  [SODFL620X110-2N]
D3  Voltage: 24.4V  [FP-SMA-MFG]  (hidden comment: SMAJ15A-13-F)
D4  Voltage: 30V  [SODFL620X110-2N]  (hidden comment: PMEG3050EP,115)
D+  5001  [KSTN-5001]  (value not drawn)
D-  5001  [KSTN-5001]  (value not drawn)
F1  0ZCF0200AF2C  value 2A  [FP-0ZCF0200AF2C-MFG]
FB1  BLM21SP601SH1D  [FP-BLM21-0_2-t0_85-e0_5-d-IPC_A]  (value not drawn)
GND  5001  [KSTN-5001]  (value not drawn)
J7  691213710002  [691213710002]
J8  USB4105-GF-A  [FP-USB4105-GF-A-MFG]
J10  QPC02SXGN-RC  [FP-QPC02SXGN-RC-MFG]
J11  QPC02SXGN-RC  [FP-QPC02SXGN-RC-MFG]
J22  TSW-102-07-S-S  [SMTC-TSW-102-07-S-S]  (value not drawn)
J23  TSW-102-07-S-S  [SMTC-TSW-102-07-S-S]  (value not drawn)
L1  DLW5ATN112MQ2L  [FIL_DLW5ATN112MQ2L]
LED3  value GRN  [WE-150060VS75000_V]  (hidden comment: 150060VS75000)
R11  value 1K  [RESC1608X55X30LL20T20]  (hidden comment: ERA3AEB102V)
R16  value 5K1  [RESC2013X70X40LL20T20]  (hidden comment: ERJ6ENF5101V)
R17  value 1K  [RESC1608X55X30LL20T20]  (hidden comment: ERA3AEB102V)
R18  value 5K1  [RESC2013X70X40LL20T20]  (hidden comment: ERJ6ENF5101V)
R19  value 25.5 kOhms  Tolerance: 0.1%  [RESC1608X50X30LL20T20]  (hidden comment: RG1608P-2552-B-T5)
R20  value 7K5  Tolerance: ±0.1%  [RESC1608X55X30LL20T20]  (hidden comment: ERA3AEB102V)
U4  USBLC6-4SC6  [SM/SOT23-6PIN]
U5  CP2102N-A02-GQFN28  [QFN50P500X500X100_HS-29N]
U6  BD00D0AWHFP-TR  [TO172P1054X2005-6N]
VIN  5001  [KSTN-5001]  (value not drawn)

### Ports
MODEM_RX, MODEM_TX

### Nets
3V3: 3V3.1 C21.2 C22.2 C23.1 R19.2 U6.4(Vo)
GND: C14.2 C15.2 C16.2 C18.2 C19.2 C20.2 C21.1 C22.1 C23.2 CAP-1.1 D3.2(A) GND.1 J7.1 L1.3 LED3.1(K) R20.1 U4.2(GND) U5.3(GND) U5.29(GND) U6.3(GND) U6.6(GND)
USB_GND: C17.2 J8.1(MNT_1) J8.2(MNT_2) J8.3(MNT_3) J8.4(MNT_4) J8.A1-B12(GND) J8.B1-A12(GND) L1.4 R16.2 R18.2
V_USB: C15.1 D4.A J8.A4-B9(VBUS) J8.B4-A9(VBUS) U4.5(VBUS) U5.7(VREGIN) U5.8(VBUS)
VBUS: C17.1 D4.K F1.2 L1.1
VBUS_CL: C19.1 C20.1 FB1.2 U6.1(CTL) U6.2(Vcc)
VBUS_POST: C18.1 FB1.1 L1.2
D_N: D-.1 J8.A7(Dn1) J8.B7(Dn2) U4.3(P2) U5.5(D-)
D_P: D+.1 J8.A6(Dp1) J8.B6(Dp2) U4.4(P3) U5.4(D+)
FB: R19.1 R20.2 U6.5(ADJ)
MODEM_RX: J22.2 ; port MODEM_RX
MODEM_TX: J23.1 ; port MODEM_TX
NetC14_1: C14.1 CAP+1.1 D2.A D3.1(C) J7.2 VIN.1
NetC16_1: C16.1 R17.1 U5.6(VDD)
NetD2_K: D2.K F1.1 R11.2
NetJ8_A5: J8.A5(CC1) R16.1
NetJ8_B5: J8.B5(CC2) R18.1
NetJ22_1: J22.1 U5.26(TXD)
NetJ23_2: J23.2 U5.25(RXD)
NetLED3_2: LED3.2(A) R11.1
NetR17_2: R17.2 U5.9(~{RST})
NetU5_23: U5.23(~{CTS}) U5.24(~{RTS})
NetU5_27: U5.27(~{DSR}) U5.28(~{DTR})

Not connected (* = marked no-connect by the designer): J8 A8(SBU1)* B8(SBU2)*; U4 1(P1)* 6(P4)*; U5 1(~{DCD})* 2(RI/CLK)* 10(NC)* 11(~{SUSPENDb})* 12(SUSPEND)* 13(CHREN)* 14(CHR1)* 15(CHR0)* 16(GPIO3)* 17(GPIO2)* 18(GPIO1)* 19(GPIO0)* 20(GPIO6)* 21(GPIO5)* 22(GPIO4)*

### Layout directives
differential pair: D_N, D_P

### Notes on the sheet
- Swarm mPCIe Breakout Board (Power Supply Page)
- +5V to 12V External Voltage Input
- Filter and Voltage Regulation
- USB-C at 1.5A
- USB to Serial
- Remove jumpers when using FTDI or RS232
- USB Voltage 4.75-5.5V Nominal
- (in symbol TitleBlock_SpaceX) Project Title:; Schematic:; SIZE; REV; B; SCALE: 1:1; SHEET:       OF

### Library data of the parts
3V3 CAP+1 CAP-1 D+ D- GND VIN = CMP-2000-05181-1: as TP1 on sheet mPCIe_Breakout01-SCH-PAGE2_MAIN; Type: TEST POINT; Manufacturer Part Number: 5001; MANUF1: Keystone Electronics; MANUF1 P/N: 5001; Size: TH; SPECIAL_INSTRUCTIONS: 5001; Supplier: Digikey; Supplier P/N: 36-5001-ND; Tolerance: NA; Voltage: NA
?#2 = TitleBlock_SpaceX: TITLE
C14-C16 = CMP-13271-000011-1: as C6 on sheet mPCIe_Breakout01-SCH-PAGE2_MAIN; Manufacturer Part Number: CGA3E2X7R1H104K080AA; Tolerance: 10%; MANUF1: TDK; MANUF1 P/N: CGA3E2X7R1H104K080AA; Size: 0603; SPECIAL_INSTRUCTIONS: CGA3E2X7R1H104K080AA; Supplier: Digi-Key; Supplier P/N: 1276-1033-2-ND; Type: CAP
  C16: Value: 100nF; Voltage: 50V
C17 C18 C20 = CMP-2007-00135-2: Chip Multilayer Ceramic Capacitors for General Purpose, 0805, 10000pF, C0G, 30ppm/°C, 5%, 50V; Manufacturer: Murata; TEMP: -55°C ~ 125°C; Type: CAP; Tolerance: 5%; Manufacturer Part Number: GRM2195C1H103JA01D; MANUF1: Murata; MANUF1 P/N: GRM2195C1H103JA01D; Size: 0805; SPECIAL_INSTRUCTIONS: GRM2195C1H103JA01D; Supplier: Digi-Key; Supplier P/N: 490-1642-2-ND
C19 = CMP-1037-04923-3: Chip Multilayer Ceramic Capacitors for General Purpose, 1206, 4.7uF, X7R, 15%, 10%, 50V; Manufacturer: TDK; Manufacturer Part Number: C3216X5R1H475K; TEMP: 445-5994-2-ND; Type: CAP; Tolerance: 10%; MANUF1: TDK; MANUF1 P/N: C3216X5R1H475K; Size: 1206; SPECIAL_INSTRUCTIONS: C3216X5R1H475K; Supplier: Digi-Key; Supplier P/N: C3216X5R1H475K
C21 C22 = CMP-2007-03555-1: 4.7 µF ±10% 10V Ceramic Capacitor X7R 0805 (2012 Metric); Manufacturer: Murata; TEMP: -55°C ~ 125°C; Type: CAP; Manufacturer Part Number: GRM21BR71A475KA73L; MANUF1: Murata; MANUF1 P/N: GRM21BR71A475KA73L; Size: 0805; SPECIAL_INSTRUCTIONS: GRM21BR71A475KA73L; Supplier: Digi-Key; Supplier P/N: 490-6480-2-ND; Tolerance: 10%
C23 = CMP-06035-048205-1: as C8 on sheet mPCIe_Breakout01-SCH-PAGE2_MAIN; Tolerance: 20%; Manufacturer Part Number: GRM32ER61A107ME20L; MANUF1: Murata; MANUF1 P/N: GRM32ER61A107ME20L; Size: 1210; SPECIAL_INSTRUCTIONS: GRM32ER61A107ME20L; Supplier: Digi-Key; Supplier P/N: 490-9969-2-ND
D2 D4 = PMEG3050EP,115: DIODE SCHOTTKY 30V 5A SOD128; MANUF1: NXP Semiconductors; Tolerance: NA; TEMP: -55°C ~ 175°C; 1K COST: .28; Size: SOD-128; Value: 5A; Supplier: Digikey; Supplier P/N: 1727-5317-1-ND; Type: DIODE; SPECIAL_INSTRUCTIONS: PMEG3050EP,115; MANUF1 P/N: PMEG3050EP,115; Manufacturer: NXP Semiconductors; Manufacturer Part Number: PMEG3050EP,115
  D2: Voltage: 30V
D3 = CMP-12828-000004-1: TVS DIODE 15V 24.4V SMA; Manufacturer: Diodes; TEMP: -50°C ~ 150°C; Tolerance: NA; Value: NA; Manufacturer Part Number: SMAJ15A-13-F; MANUF1: Diodes; MANUF1 P/N: SMAJ15A-13-F; Size: SMA; SPECIAL_INSTRUCTIONS: SMAJ15A-13-F; Supplier: Digikey; Supplier P/N: SMAJ15A-FDITR-ND; Type: DIODE
F1 = CMP-16043-000006-1: PTC RESET FUSE 24V 2A 2920; Manufacturer: Bel; TEMP: -40°C ~ 85°C; Tolerance: NA; Manufacturer Part Number: 0ZCF0200AF2C; MANUF1: Bel; MANUF1 P/N: 0ZCF0200AF2C; Size: 2920; SPECIAL_INSTRUCTIONS: 0ZCF0200AF2C; Supplier: Digikey; Supplier P/N: 507-1749-2-ND; Type: FUSE; Voltage: 24V
FB1 = CMP-06046-001905-1: Chip Ferrite Bead, 0805, 600Ω @ 100MHz, 0.06Ω, 25%, 2.3A; Manufacturer: Murata; TEMP: -55°C ~ 125°C; Tolerance: NA; Value: 600 Ohms @ 100 MHz; Manufacturer Part Number: BLM21SP601SH1D; MANUF1: Murata; MANUF1 P/N: BLM21SP601SH1D; Size: 0805; SPECIAL_INSTRUCTIONS: BLM21SP601SH1D; Supplier: Digi-Key; Supplier P/N: 490-18588-2-ND; Type: FERRITE; Voltage: NA
J7 = 691213710002: HEADER, 2 Position Wire to Board Terminal Block Horizontal with Board 0.197" (5.00mm) Through Hole; MANUF1: Wurth Electronics Inc.; 1K COST: .68; TEMP: -40°C ~ 105°C; Value: Green; Voltage: 300V; MANUF1 P/N: 691213710002; Size: 5mm; SPECIAL_INSTRUCTIONS: 691213710002; Supplier: Digikey; Supplier P/N: 732-2038-ND; Tolerance: n/a; Type: Wire to Board; Manufacturer: Wurth Electronics Inc.; Manufacturer Part Number: 691213710002
J8 = CMP-245163-000001-1: CONN RCPT USB2.0 TYPEC 5A; Manufacturer: Global Connector Technology; TEMP: -40°C ~ 85°C; Tolerance: NA; Value: NA; Manufacturer Part Number: USB4105-GF-A; MANUF1: Global Connector Technology; MANUF1 P/N: USB4105-GF-A; Size: SMT/TH; SPECIAL_INSTRUCTIONS: USB4105-GF-A; Supplier: Digikey; Supplier P/N: 2073-USB4105-GF-ATR-ND; Type: CONN; Voltage: NA
J10 J11 = CMP-25666-000001-1: as J9 on sheet mPCIe_Breakout01-SCH-PAGE2_MAIN; Manufacturer Part Number: QPC02SXGN-RC; MANUF1: Sullins; MANUF1 P/N: QPC02SXGN-RC; Size: 2.54MM; SPECIAL_INSTRUCTIONS: QPC02SXGN-RC; Supplier: Digi-Key; Supplier P/N: S9337-ND; Type: JUMPER; Voltage: NA
J22 J23 = CMP-1681-00004-4: as J16 on sheet mPCIe_Breakout01-SCH-PAGE2_MAIN; Manufacturer Part Number: TSW-102-07-S-S; MANUF1: Samtec; MANUF1 P/N: TSW-102-07-S-S; Size: TH; SPECIAL_INSTRUCTIONS: TSW-102-07-S-S; Supplier: Digi-Key; Supplier P/N: SAM1033-02-ND; Type: CONN; Voltage: NA
L1 = CM_Choke_DLW5ATN112MQ2L: CMC 2A 2LN 1.1 KOHM SMD; MANUF1: Murata Electronics; Tolerance: NA; Type: CMCCC; TEMP: -40°C ~ 105°C; 1K COST: 0.68; Size: SMT; SPECIAL_INSTRUCTIONS: DLW5ATN112MQ2L; Supplier: Digikey; Supplier P/N: 490-12641-2-ND; MANUF1 P/N: DLW5ATN112MQ2L; Value: 2A; Voltage: N/A; Manufacturer: Murata Electronics; Manufacturer Part Number: DLW5ATN112MQ2L
LED3 = CMP-1426-00006-4: as LED1 on sheet mPCIe_Breakout01-SCH-PAGE2_MAIN; Manufacturer Part Number: 150060VS75000; MANUF1: Wurth Electronics; MANUF1 P/N: 150060VS75000; Size: 0603; SPECIAL_INSTRUCTIONS: 150060VS75000; Supplier: Digi-Key; Supplier P/N: 732-4980-2-ND; Type: LED
R11 R17 = CMP-2000-00873-1: as R7 on sheet mPCIe_Breakout01-SCH-PAGE2_MAIN; MANUF1: Panasonic; MANUF1 P/N: ERA-3AEB102V; Size: 0603; SPECIAL_INSTRUCTIONS: ERA-3AEB102V; Supplier: Digi-Key; Supplier P/N: P1.0KDBTR-ND; Tolerance: ±0.1%; Type: RES
R16 R18 = CMP-2001-00553-1: RES SMD 5.1K OHM 1% 1/8W 0805; Manufacturer: Panasonic; Manufacturer Part Number: ERJ-6ENF5101V; TEMP: -55°C ~ 155°C; Voltage: NA; MANUF1: Panasonic; MANUF1 P/N: ERJ-6ENF5101V; Size: 0603; SPECIAL_INSTRUCTIONS: ERJ-6ENF5101V; Supplier: Digi-Key; Supplier P/N: P5.10KCTR-ND; Tolerance: ±1%; Type: RES
R19 = CMP-2000-02146-1: RES SMD 25.5KOHM 0.1% 1/10W 0603; Manufacturer: Susumu; TEMP: -55°C ~ 125°C; Voltage: NA; Manufacturer Part Number: RG1608P-2552-B-T5; MANUF1: Susumu; MANUF1 P/N: RG1608P-2552-B-T5; Size: 0603; SPECIAL_INSTRUCTIONS: RG1608P-2552-B-T5; Supplier: Digi-Key; Supplier P/N: RG16P25.5KBTR-ND; Type: RES
R20 = CMP-2000-00873-1_1: RES SMD 7.5K OHM 0.1% 1/10W 0603; Manufacturer: Panasonic; Manufacturer Part Number: ERA-3AEB752V; TEMP: -55°C ~ 155°C; Voltage: NA; MANUF1: Panasonic; MANUF1 P/N: ERA-3AEB752V; Size: 0603; SPECIAL_INSTRUCTIONS: ERA-3AEB752V; Supplier: Digi-Key; Supplier P/N: P7.5KDBTR-ND; Type: RES
U4 = USBLC6-4: USB ESD PROTECTION; MANUF1: STMicroelectronics; TEMP: -40°C ~ 125°C; 1K COST: 0.17903; MANUF1 P/N: USBLC6-4SC6; Size: SOT-23-6; SPECIAL_INSTRUCTIONS: USBLC6-4SC6; Supplier: Digi-Key; Supplier P/N: 497-4492-2-ND; Tolerance: N/A; Type: N/A; Value: N/A; Voltage: N/A; Manufacturer: STMicroelectronics; Manufacturer Part Number: USBLC6-4SC6
U5 = CP2102N-A02-GQFN28: USB Bridge, USB to UART USB 2.0 UART Interface 28-QFN (5x5); MANUF1: Silicon Labs; 1K COST: 1.22; TEMP: -40°C ~ 85°C; Size: QFN-28; SPECIAL_INSTRUCTIONS: CP2102N-A02-GQFN28; Supplier: Digi-Key; Supplier P/N: 336-5890-2-ND; Tolerance: N/A; Type: IC; Value: N/A; Voltage: N/A; MANUF1 P/N: CP2102N-A02-GQFN28; Manufacturer: Silicon Labs; Manufacturer Part Number: CP2102N-A02-GQFN28
U6 = BD00D0AWHFP-TR: 2A Standard / Variable Output LDO Regulator; MANUF1: Rohm; TEMP: -40°C ~ 105°C; Tolerance: NA; Value: 0.55V @ 1A; Voltage: 25V; MANUF1 P/N: BD00D0AWHFP-TR; Manufacturer: Rohm; Manufacturer Part Number: BD00D0AWHFP-TR; Size: HRP-5; SPECIAL_INSTRUCTIONS: BD00D0AWHFP-TR; Supplier: Digi-Key; Supplier P/N: BD00D0AWHFPTR-ND; Type: IC

## Nets that join several sheets
3V3: mPCIe_Breakout01-SCH-PAGE2_MAIN (10 pins), mPCIe_Breakout01_SCH-PAGE3_POWER_SUPPLY (6 pins)
GND: mPCIe_Breakout01-SCH-PAGE2_MAIN (60 pins), mPCIe_Breakout01_SCH-PAGE3_POWER_SUPPLY (21 pins)
VBUS_CL: mPCIe_Breakout01-SCH-PAGE2_MAIN (J16.1 J17.1), mPCIe_Breakout01_SCH-PAGE3_POWER_SUPPLY (5 pins)
MODEM_RX: mPCIe_Breakout01-SCH-PAGE2_MAIN (7 pins), mPCIe_Breakout01_SCH-PAGE3_POWER_SUPPLY (J22.2)
MODEM_TX: mPCIe_Breakout01-SCH-PAGE2_MAIN (7 pins), mPCIe_Breakout01_SCH-PAGE3_POWER_SUPPLY (J23.1)

## Assembly variants
mPCIe_Breakout01: not fitted 1PPS 3V3 3V3_M138 +5V ARD_3V3 ARDREF1 C10 C12 C22 C23 CAP+1 CAP-1 D+ D- GND GPIO1 M138_RX M138_TX R1 R8 T/R VIN